# Altium schematic sheet MCU.SchDoc: MCU
size B; Author: James Mackaman; SheetNumber: 1; SheetTotal: 7
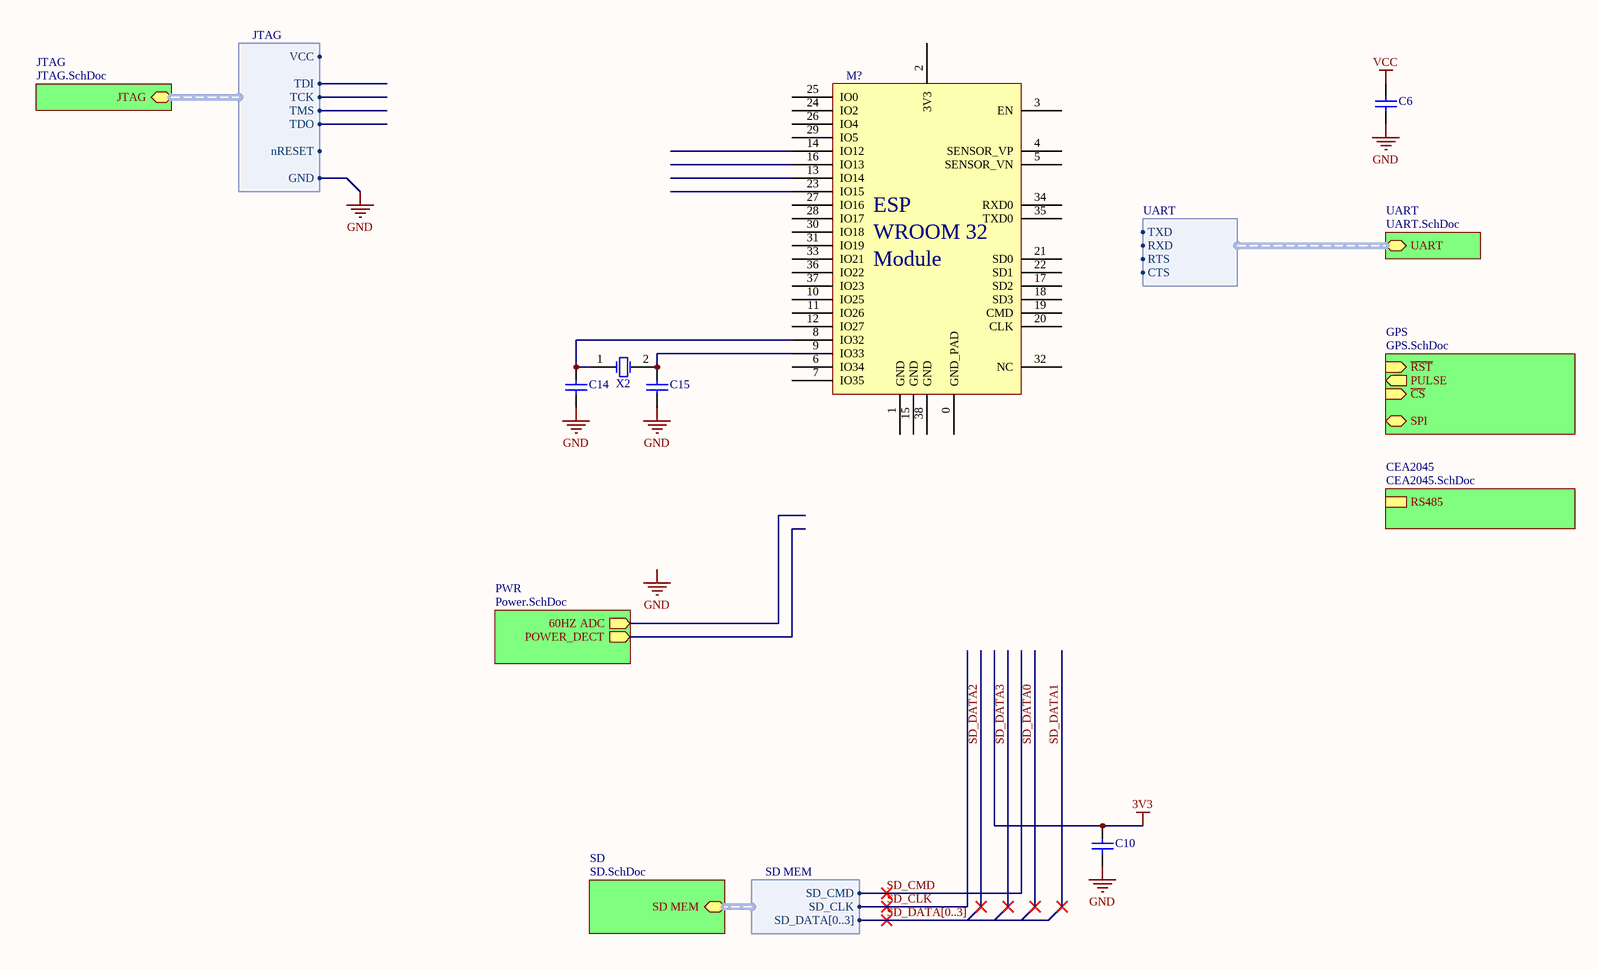
[diagram p0: MCU.SchDoc, left]
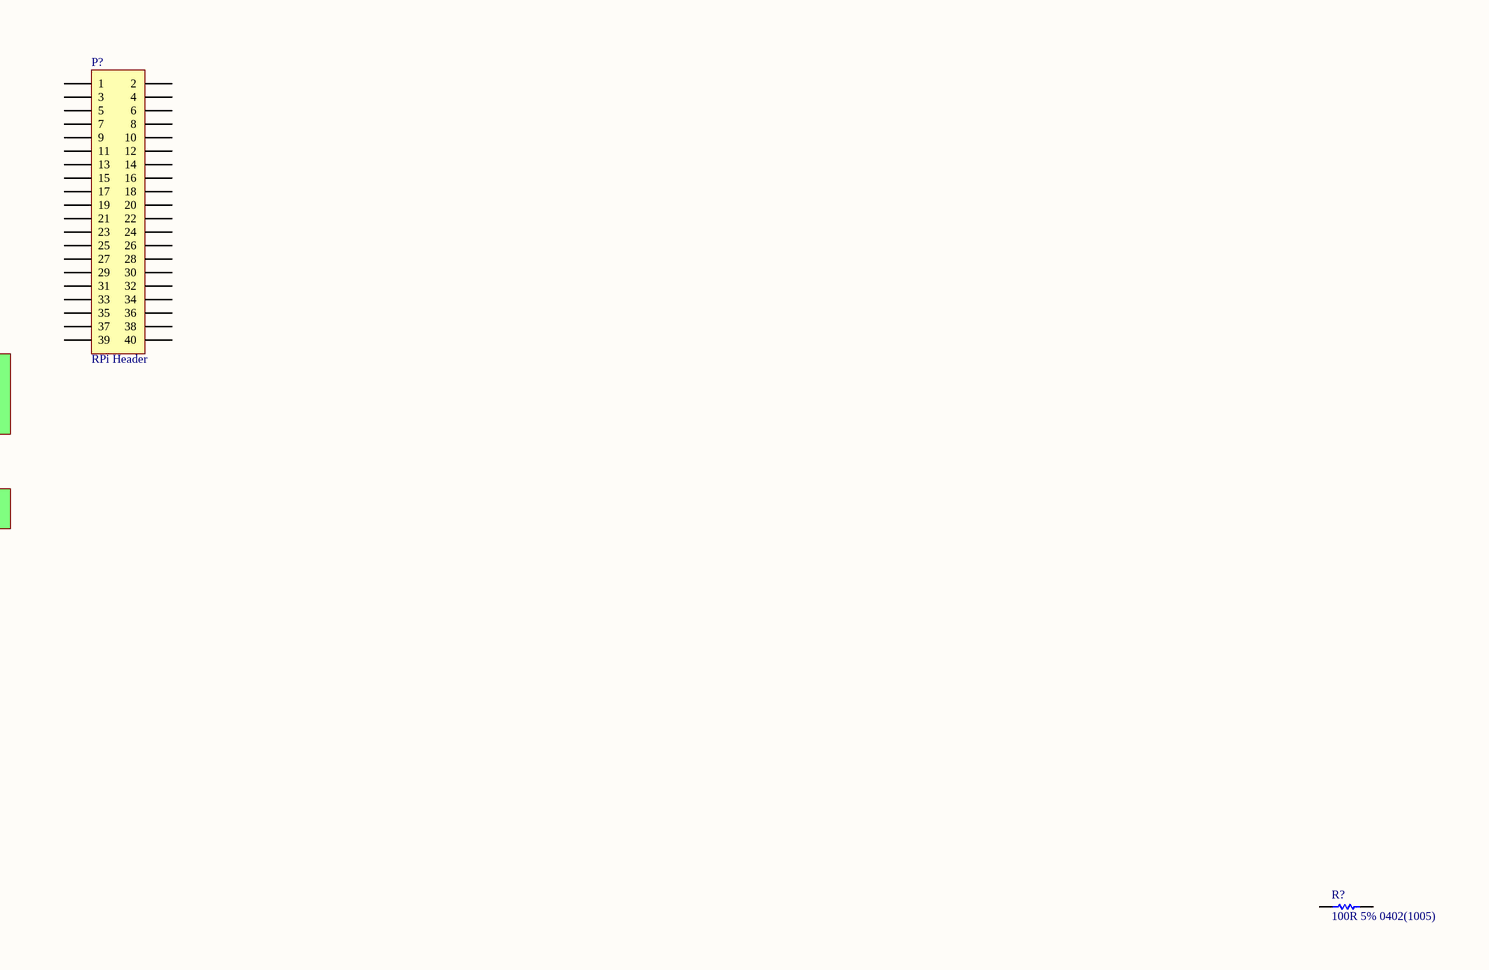
[diagram p1: MCU.SchDoc, right]

## Parts
C6  CAP 100nF 6.3V 0603(1608)  [CAPC0603(1608)100_M]  (value not drawn)
C10  CAP 100nF 6.3V 0603(1608)  [CAPC0603(1608)100_M]  (value not drawn)
C14  CAP 12pF 16V 0603(1608)  [CAPC0603(1608)100_M]  (value not drawn)
C15  CAP 12pF 16V 0603(1608)  [CAPC0603(1608)100_M]  (value not drawn)
M?  ESP-WROOM-32  (value not drawn)
P?  RPi Header  [HDR2X20]
R?  100R 5% 0402(1005)  [RESC0402(1005)_M]
X2  14340272-32.768KHz  [ITTI-14340272-32.768KHz-2_V]  (value not drawn)

## Sub-sheets
CEA2045 = CEA2045.SchDoc: RS485 (harness RS485)
GPS = GPS.SchDoc: SPI (harness SPI), ~{CS} (in), PULSE (out), ~{RST} (in)
JTAG = JTAG.SchDoc: JTAG (harness JTAG)
PWR = Power.SchDoc: 60HZ ADC (out), POWER_DECT (out)
SD = SD.SchDoc: SD MEM (harness SD MEM)
UART = UART.SchDoc: UART (harness UART)

## Harnesses
UART: TXD, RXD, RTS, CTS
SD MEM: SD_DATA[0..3], SD_CLK, SD_CMD
JTAG: TCK, TDI, TDO, TMS, nRESET, VCC, GND

## Nets
3V3: C10.2
GND: C6.1 C10.1 C14.1 C15.1 ; sheet JTAG/JTAG.GND
VCC: C6.2
SD_CLK: sheet SD/SD MEM.SD_CLK
SD_CMD: sheet SD/SD MEM.SD_CMD
NetC14_2: C14.2 M?.8(IO32) X2.1(X1)
NetC15_2: C15.2 M?.9(IO33) X2.2(X2)

Not connected (* = marked no-connect by the designer): M? 0(GND_PAD) 1(GND) 2(3V3) 3(EN) 4(SENSOR_VP) 5(SENSOR_VN) 6(IO34) 7(IO35) 10(IO25) 11(IO26) 12(IO27) 13(IO14) 14(IO12) 15(GND) 16(IO13) 17(SD2) 18(SD3) 19(CMD) 20(CLK) 21(SD0) 22(SD1) 23(IO15) 24(IO2) 25(IO0) 26(IO4) 27(IO16) 28(IO17) 29(IO5) 30(IO18) 31(IO19) 32(NC) 33(IO21) 34(RXD0) 35(TXD0) 36(IO22) 37(IO23) 38(GND); P? 1 2 3 4 5 6 7 8 9 10 11 12 13 14 15 16 17 18 19 20 21 22 23 24 25 26 27 28 29 30 31 32 33 34 35 36 37 38 39 40; R? 1 2

## Buses and harness runs
bus SD_DATA[0..3]

## Notes on the sheet
- Labels drawn without touching a wire or pin: GND
- (in symbol ESP-WROOM-32) ESP; WROOM 32; Module

## Library data of the parts
C6 C10 = CMP-1035-02575-1: CAP 100nF 6.3V ±5% 0603 (1608 Metric) Thickness 1mm SMD; Case-EIA: 0603; Tolerance: Â±5%; Case-Metric: 1608; Technology: SMT; Value: 100nF; Rated Voltage: 6.3 V; Max Thickness: 1 mm
C14 C15 = CMP-1035-00607-1: CAP 12pF 16V ±10% 0603 (1608 Metric) Thickness 1mm SMD; Case-Metric: 1608; Tolerance: Â±10%; Case-EIA: 0603; Value: 12pF; Max Thickness: 1 mm; Technology: SMT; Rated Voltage: 16 V
M? = ESP-WROOM-32: ESP WROOM 32 Module; Supplier 1: Digi-Key; Supplier Part Number 1: 1528-1801-ND
P? = Header 20X2: Header, 20-Pin, Dual row; LatestRevisionDate: 17-Jul-2002; LatestRevisionNote: Re-released for DXP Platform.; Publisher: Altium Limited
R? = CMP-1011-00050-1: 100R 0.063W 5% 0402 (1005 Metric)  SMD; Value: 100.00 Ohm; Case-Metric: 1005; Case-EIA: 0402; Power: 0.063 W; Technology: SMT; Tolerance: 5 %
X2 = CMP-0463-00001-2: Crystal, 32.768 KHz, -40 to 85 degC, 3.2 x 1.5 x 0.9 mm SMD; Manufacturer: ITTI; Load Capacitance: 12.5 pF; Frequency Tolerance: +/-20 ppm; Drive Level: 1 max. uw; Nominal Frequency: 32.768KHz; Mounting Technology: Surface Mount; Operating temperature: -40 to 85 degC; PartNumber: 14340272-32.768KHz; ComponentLink1URL: http://www.itti-co.com; ComponentLink1Description: Manufacturer URL; PackageReference: 14340272-32.768KHz-2; PackageDescription: 2-Pin Hand Drawn, Body 3.2 x 1.5mm, Pitch 2.5 mm